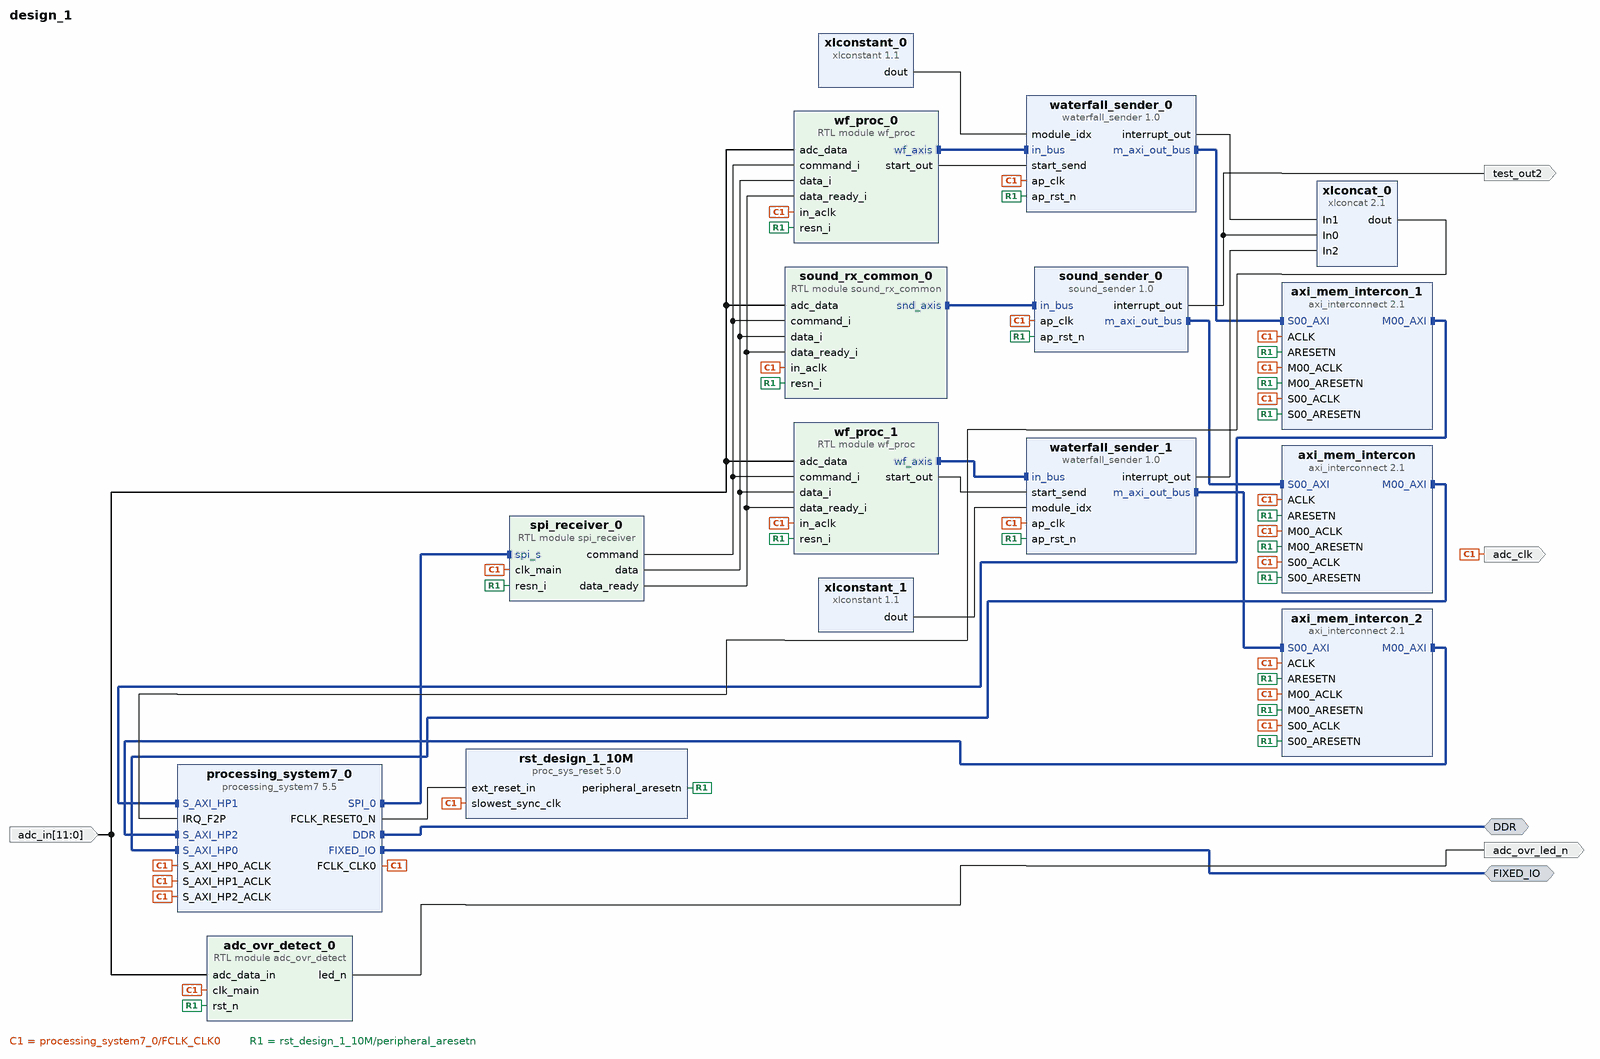
[diagram p0: block diagram of the top level]
# Vivado block design design_1, xc7z010clg400-1, Vivado 2022.2
create_bd_design design_1

create_bd_intf_port -mode Master -vlnv xilinx.com:interface:ddrx_rtl:1.0 DDR
create_bd_intf_port -mode Master -vlnv xilinx.com:display_processing_system7:fixedio_rtl:1.0 FIXED_IO
create_bd_port -dir O test_out2
create_bd_port -dir O adc_clk
create_bd_port -dir I -from 11 -to 0 adc_in
create_bd_port -dir O adc_ovr_led_n

create_bd_cell -type ip -vlnv xilinx.com:ip:processing_system7:5.5 processing_system7_0
set_property -dict [list \
  CONFIG.PCW_APU_PERIPHERAL_FREQMHZ 666.666666 \
  CONFIG.PCW_ENET0_ENET0_IO {MIO 16 .. 27} \
  CONFIG.PCW_ENET0_GRP_MDIO_ENABLE 1 \
  CONFIG.PCW_ENET0_GRP_MDIO_IO {MIO 52 .. 53} \
  CONFIG.PCW_ENET0_PERIPHERAL_ENABLE 1 \
  CONFIG.PCW_ENET0_RESET_ENABLE 0 \
  CONFIG.PCW_ENET_RESET_ENABLE 1 \
  CONFIG.PCW_ENET_RESET_SELECT {Share reset pin} \
  CONFIG.PCW_FCLK_CLK0_BUF FALSE \
  CONFIG.PCW_FPGA0_PERIPHERAL_FREQMHZ 40 \
  CONFIG.PCW_FPGA1_PERIPHERAL_FREQMHZ 50 \
  CONFIG.PCW_GPIO_MIO_GPIO_ENABLE 1 \
  CONFIG.PCW_GPIO_MIO_GPIO_IO MIO \
  CONFIG.PCW_I2C_RESET_ENABLE 1 \
  CONFIG.PCW_IRQ_F2P_INTR 1 \
  CONFIG.PCW_PERIPHERAL_BOARD_PRESET None \
  CONFIG.PCW_PRESET_BANK1_VOLTAGE {LVCMOS 2.5V} \
  CONFIG.PCW_QSPI_PERIPHERAL_ENABLE 0 \
  CONFIG.PCW_SD0_GRP_CD_ENABLE 1 \
  CONFIG.PCW_SD0_GRP_CD_IO {MIO 46} \
  CONFIG.PCW_SD0_GRP_WP_ENABLE 0 \
  CONFIG.PCW_SD0_PERIPHERAL_ENABLE 1 \
  CONFIG.PCW_SD0_SD0_IO {MIO 40 .. 45} \
  CONFIG.PCW_SDIO_PERIPHERAL_FREQMHZ 100 \
  CONFIG.PCW_SPI0_PERIPHERAL_ENABLE 1 \
  CONFIG.PCW_SPI0_SPI0_IO EMIO \
  CONFIG.PCW_UART1_PERIPHERAL_ENABLE 1 \
  CONFIG.PCW_UART1_UART1_IO {MIO 48 .. 49} \
  CONFIG.PCW_UART_PERIPHERAL_FREQMHZ 100 \
  CONFIG.PCW_UIPARAM_DDR_FREQ_MHZ 533.333333 \
  CONFIG.PCW_UIPARAM_DDR_PARTNO {MT41K128M16 JT-125} \
  CONFIG.PCW_USB0_PERIPHERAL_ENABLE 0 \
  CONFIG.PCW_USB_RESET_ENABLE 1 \
  CONFIG.PCW_USE_FABRIC_INTERRUPT 1 \
  CONFIG.PCW_USE_M_AXI_GP0 0 \
  CONFIG.PCW_USE_S_AXI_HP0 1 \
  CONFIG.PCW_USE_S_AXI_HP1 1 \
  CONFIG.PCW_USE_S_AXI_HP2 1 \
  CONFIG.preset None \
] [get_bd_cells processing_system7_0]
# 504 more settings of processing_system7_0 are not shown: defaults, MIO pin electricals, DDR timing, and values the tool derives
create_bd_cell -type ip -vlnv xilinx.com:ip:proc_sys_reset:5.0 rst_design_1_10M
create_bd_cell -type module -reference spi_receiver spi_receiver_0
create_bd_cell -type ip -vlnv xilinx.com:ip:xlconcat:2.1 xlconcat_0
set_property -dict {CONFIG.NUM_PORTS 3} [get_bd_cells xlconcat_0]
create_bd_cell -type ip -vlnv xilinx.com:ip:xlconstant:1.1 xlconstant_0
set_property -dict {CONFIG.CONST_VAL 0} [get_bd_cells xlconstant_0]
create_bd_cell -type ip -vlnv xilinx.com:ip:xlconstant:1.1 xlconstant_1
set_property -dict {CONFIG.CONST_VAL 1} [get_bd_cells xlconstant_1]
create_bd_cell -type ip -vlnv xilinx.com:ip:axi_interconnect:2.1 axi_mem_intercon_2
set_property -dict {CONFIG.ENABLE_ADVANCED_OPTIONS 1 CONFIG.NUM_MI 1 CONFIG.NUM_SI 1} [get_bd_cells axi_mem_intercon_2]
create_bd_cell -type ip -vlnv xilinx.com:ip:axi_interconnect:2.1 axi_mem_intercon_1
set_property -dict {CONFIG.ENABLE_ADVANCED_OPTIONS 1 CONFIG.NUM_MI 1 CONFIG.NUM_SI 1} [get_bd_cells axi_mem_intercon_1]
create_bd_cell -type ip -vlnv xilinx.com:ip:axi_interconnect:2.1 axi_mem_intercon
set_property -dict {CONFIG.ENABLE_ADVANCED_OPTIONS 1 CONFIG.NUM_MI 1} [get_bd_cells axi_mem_intercon]
create_bd_cell -type module -reference adc_ovr_detect adc_ovr_detect_0
create_bd_cell -type ip -vlnv xilinx.com:hls:sound_sender:1.0 sound_sender_0
set_property -dict {CONFIG.C_M_AXI_OUT_BUS_DATA_WIDTH 32} [get_bd_cells sound_sender_0]
create_bd_cell -type ip -vlnv xilinx.com:hls:waterfall_sender:1.0 waterfall_sender_0
set_property -dict {CONFIG.C_M_AXI_OUT_BUS_DATA_WIDTH 64} [get_bd_cells waterfall_sender_0]
create_bd_cell -type ip -vlnv xilinx.com:hls:waterfall_sender:1.0 waterfall_sender_1
set_property -dict {CONFIG.C_M_AXI_OUT_BUS_DATA_WIDTH 64} [get_bd_cells waterfall_sender_1]
create_bd_cell -type module -reference wf_proc wf_proc_0
set_property -dict {CONFIG.WF_INDEX 1} [get_bd_cells wf_proc_0]
create_bd_cell -type module -reference wf_proc wf_proc_1
set_property -dict {CONFIG.WF_INDEX 2} [get_bd_cells wf_proc_1]
create_bd_cell -type module -reference sound_rx_common sound_rx_common_0

# ---- connections ----

connect_bd_intf_net [get_bd_intf_pins axi_mem_intercon_1/M00_AXI] [get_bd_intf_pins processing_system7_0/S_AXI_HP1]
connect_bd_intf_net -intf_net axi_mem_intercon_1_M01_AXI [get_bd_intf_pins axi_mem_intercon_2/M00_AXI] [get_bd_intf_pins processing_system7_0/S_AXI_HP2]
connect_bd_intf_net [get_bd_intf_pins axi_mem_intercon/M00_AXI] [get_bd_intf_pins processing_system7_0/S_AXI_HP0]
connect_bd_intf_net [get_bd_intf_ports DDR] [get_bd_intf_pins processing_system7_0/DDR]
connect_bd_intf_net [get_bd_intf_ports FIXED_IO] [get_bd_intf_pins processing_system7_0/FIXED_IO]
connect_bd_intf_net [get_bd_intf_pins spi_receiver_0/spi_s] [get_bd_intf_pins processing_system7_0/SPI_0]
connect_bd_intf_net [get_bd_intf_pins sound_rx_common_0/snd_axis] [get_bd_intf_pins sound_sender_0/in_bus]
connect_bd_intf_net [get_bd_intf_pins sound_sender_0/m_axi_out_bus] [get_bd_intf_pins axi_mem_intercon/S00_AXI]
connect_bd_intf_net [get_bd_intf_pins waterfall_sender_0/m_axi_out_bus] [get_bd_intf_pins axi_mem_intercon_1/S00_AXI]
connect_bd_intf_net [get_bd_intf_pins waterfall_sender_1/m_axi_out_bus] [get_bd_intf_pins axi_mem_intercon_2/S00_AXI]
connect_bd_intf_net [get_bd_intf_pins waterfall_sender_0/in_bus] [get_bd_intf_pins wf_proc_0/wf_axis]
connect_bd_intf_net [get_bd_intf_pins waterfall_sender_1/in_bus] [get_bd_intf_pins wf_proc_1/wf_axis]
connect_bd_net [get_bd_pins adc_ovr_detect_0/led_n] [get_bd_ports adc_ovr_led_n]
connect_bd_net -net adc_sim_conv_0_sim_data_out [get_bd_ports adc_in] \
  [get_bd_pins adc_ovr_detect_0/adc_data_in] [get_bd_pins wf_proc_0/adc_data] [get_bd_pins wf_proc_1/adc_data] \
  [get_bd_pins sound_rx_common_0/adc_data]
connect_bd_net -net interrupt_out [get_bd_pins sound_sender_0/interrupt_out] [get_bd_ports test_out2] [get_bd_pins xlconcat_0/In0]
connect_bd_net [get_bd_pins processing_system7_0/FCLK_CLK0] \
  [get_bd_pins rst_design_1_10M/slowest_sync_clk] [get_bd_pins spi_receiver_0/clk_main] \
  [get_bd_pins processing_system7_0/S_AXI_HP0_ACLK] [get_bd_pins processing_system7_0/S_AXI_HP1_ACLK] [get_bd_ports adc_clk] \
  [get_bd_pins processing_system7_0/S_AXI_HP2_ACLK] [get_bd_pins axi_mem_intercon_2/ACLK] \
  [get_bd_pins axi_mem_intercon_2/M00_ACLK] [get_bd_pins axi_mem_intercon_2/S00_ACLK] [get_bd_pins axi_mem_intercon_1/ACLK] \
  [get_bd_pins axi_mem_intercon_1/M00_ACLK] [get_bd_pins axi_mem_intercon_1/S00_ACLK] [get_bd_pins axi_mem_intercon/ACLK] \
  [get_bd_pins axi_mem_intercon/M00_ACLK] [get_bd_pins axi_mem_intercon/S00_ACLK] [get_bd_pins adc_ovr_detect_0/clk_main] \
  [get_bd_pins sound_sender_0/ap_clk] [get_bd_pins waterfall_sender_0/ap_clk] [get_bd_pins waterfall_sender_1/ap_clk] \
  [get_bd_pins wf_proc_0/in_aclk] [get_bd_pins wf_proc_1/in_aclk] [get_bd_pins sound_rx_common_0/in_aclk]
connect_bd_net [get_bd_pins processing_system7_0/FCLK_RESET0_N] [get_bd_pins rst_design_1_10M/ext_reset_in]
connect_bd_net [get_bd_pins rst_design_1_10M/peripheral_aresetn] \
  [get_bd_pins axi_mem_intercon_1/ARESETN] [get_bd_pins axi_mem_intercon_1/M00_ARESETN] \
  [get_bd_pins axi_mem_intercon_1/S00_ARESETN] [get_bd_pins axi_mem_intercon/ARESETN] \
  [get_bd_pins axi_mem_intercon/M00_ARESETN] [get_bd_pins axi_mem_intercon/S00_ARESETN] [get_bd_pins sound_sender_0/ap_rst_n] \
  [get_bd_pins waterfall_sender_0/ap_rst_n] [get_bd_pins waterfall_sender_1/ap_rst_n] [get_bd_pins spi_receiver_0/resn_i] \
  [get_bd_pins adc_ovr_detect_0/rst_n] [get_bd_pins axi_mem_intercon_2/ARESETN] [get_bd_pins axi_mem_intercon_2/S00_ARESETN] \
  [get_bd_pins axi_mem_intercon_2/M00_ARESETN] [get_bd_pins wf_proc_0/resn_i] [get_bd_pins wf_proc_1/resn_i] \
  [get_bd_pins sound_rx_common_0/resn_i]
connect_bd_net [get_bd_pins spi_receiver_0/command] \
  [get_bd_pins wf_proc_0/command_i] [get_bd_pins wf_proc_1/command_i] [get_bd_pins sound_rx_common_0/command_i]
connect_bd_net [get_bd_pins spi_receiver_0/data] [get_bd_pins wf_proc_0/data_i] [get_bd_pins wf_proc_1/data_i] [get_bd_pins sound_rx_common_0/data_i]
connect_bd_net [get_bd_pins spi_receiver_0/data_ready] \
  [get_bd_pins wf_proc_0/data_ready_i] [get_bd_pins wf_proc_1/data_ready_i] [get_bd_pins sound_rx_common_0/data_ready_i]
connect_bd_net [get_bd_pins waterfall_sender_0/interrupt_out] [get_bd_pins xlconcat_0/In1]
connect_bd_net [get_bd_pins waterfall_sender_1/interrupt_out] [get_bd_pins xlconcat_0/In2]
connect_bd_net [get_bd_pins wf_proc_0/start_out] [get_bd_pins waterfall_sender_0/start_send]
connect_bd_net [get_bd_pins wf_proc_1/start_out] [get_bd_pins waterfall_sender_1/start_send]
connect_bd_net [get_bd_pins xlconcat_0/dout] [get_bd_pins processing_system7_0/IRQ_F2P]
connect_bd_net [get_bd_pins xlconstant_0/dout] [get_bd_pins waterfall_sender_0/module_idx]
connect_bd_net [get_bd_pins xlconstant_1/dout] [get_bd_pins waterfall_sender_1/module_idx]

# ---- address map ----
assign_bd_address -offset 0x00000000 -range 512M -target_address_space [get_bd_addr_spaces sound_sender_0/Data_m_axi_out_bus] [get_bd_addr_segs processing_system7_0/S_AXI_HP0/HP0_DDR_LOWOCM]
assign_bd_address -offset 0x0000000000000000 -range 512M -target_address_space [get_bd_addr_spaces waterfall_sender_0/Data_m_axi_out_bus] [get_bd_addr_segs processing_system7_0/S_AXI_HP1/HP1_DDR_LOWOCM]
assign_bd_address -offset 0x0000000000000000 -range 512M -target_address_space [get_bd_addr_spaces waterfall_sender_1/Data_m_axi_out_bus] [get_bd_addr_segs processing_system7_0/S_AXI_HP2/HP2_DDR_LOWOCM]

validate_bd_design
save_bd_design
